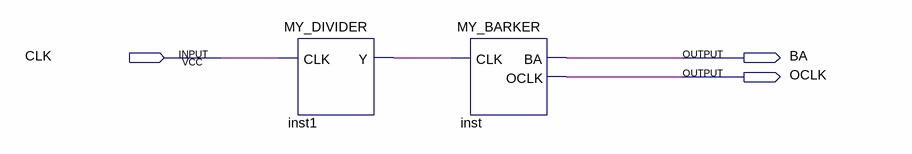
[diagram p0: schematic sheet]
// Quartus schematic TEST_BARKER.bdf as structural Verilog: 2 symbols, 3 pins
module TEST_BARKER (
  input  CLK,
  output BA,
  output OCLK
);

  wire inst1_y;

  MY_DIVIDER inst1 (.CLK(CLK), .Y(inst1_y));
  MY_BARKER inst (.CLK(inst1_y), .BA(BA), .OCLK(OCLK));
endmodule
